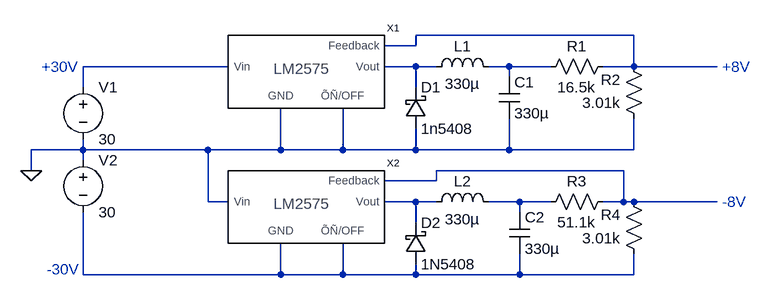
[diagram p0: schematic RapportDrawing.asc]
RapportDrawing.asc, the LTspice schematic file:
Version 4
SHEET 1 880 680
WIRE 480 -32 144 -32
WIRE 144 -16 144 -32
WIRE 144 -16 96 -16
WIRE -144 16 -368 16
WIRE 144 16 96 16
WIRE 176 16 144 16
WIRE 288 16 256 16
WIRE 352 16 288 16
WIRE 480 16 480 -32
WIRE 480 16 432 16
WIRE 608 16 480 16
WIRE 288 32 288 16
WIRE -368 48 -368 16
WIRE 144 48 144 16
WIRE -368 144 -368 128
WIRE -368 144 -448 144
WIRE -176 144 -368 144
WIRE -64 144 -64 80
WIRE -64 144 -176 144
WIRE 32 144 32 80
WIRE 32 144 -64 144
WIRE 144 144 144 112
WIRE 144 144 32 144
WIRE 288 144 288 96
WIRE 288 144 144 144
WIRE 480 144 480 96
WIRE 480 144 288 144
WIRE -368 160 -368 144
WIRE -448 176 -448 144
WIRE 464 176 176 176
WIRE 176 192 176 176
WIRE 176 192 96 192
WIRE -176 224 -176 144
WIRE -144 224 -176 224
WIRE 144 224 96 224
WIRE 176 224 144 224
WIRE 304 224 256 224
WIRE 352 224 304 224
WIRE 464 224 464 176
WIRE 464 224 432 224
WIRE 480 224 464 224
WIRE 608 224 480 224
WIRE 304 240 304 224
WIRE 144 256 144 224
WIRE -368 336 -368 240
WIRE -64 336 -64 288
WIRE -64 336 -368 336
WIRE 32 336 32 288
WIRE 32 336 -64 336
WIRE 144 336 144 320
WIRE 144 336 32 336
WIRE 304 336 304 304
WIRE 304 336 144 336
WIRE 480 336 480 304
WIRE 480 336 304 336
FLAG -448 176 0
SYMBOL LM2575 -80 64 R0
SYMATTR InstName X1
SYMBOL voltage -368 32 R0
WINDOW 123 0 0 Left 0
WINDOW 39 0 0 Left 0
SYMATTR InstName V1
SYMATTR Value 30
SYMBOL voltage -368 144 R0
WINDOW 123 0 0 Left 0
WINDOW 39 0 0 Left 0
SYMATTR InstName V2
SYMATTR Value 30
SYMBOL ind 160 32 R270
WINDOW 0 32 56 VTop 2
WINDOW 3 5 56 VBottom 2
SYMATTR InstName L1
SYMATTR Value 330µ
SYMBOL cap 272 32 R0
SYMATTR InstName C1
SYMATTR Value 330µ
SYMBOL res 448 0 R90
WINDOW 0 0 56 VBottom 2
WINDOW 3 32 56 VTop 2
SYMATTR InstName R1
SYMATTR Value 16.5k
SYMBOL res 496 112 R180
WINDOW 0 36 76 Left 2
WINDOW 3 36 40 Left 2
SYMATTR InstName R2
SYMATTR Value 3.01k
SYMBOL LM2575 -80 272 R0
SYMATTR InstName X2
SYMBOL ind 160 240 R270
WINDOW 0 32 56 VTop 2
WINDOW 3 5 56 VBottom 2
SYMATTR InstName L2
SYMATTR Value 330µ
SYMBOL cap 288 240 R0
SYMATTR InstName C2
SYMATTR Value 330µ
SYMBOL res 448 208 R90
WINDOW 0 0 56 VBottom 2
WINDOW 3 32 56 VTop 2
SYMATTR InstName R3
SYMATTR Value 51.1k
SYMBOL res 496 320 R180
WINDOW 0 36 76 Left 2
WINDOW 3 36 40 Left 2
SYMATTR InstName R4
SYMATTR Value 3.01k
SYMBOL schottky 128 112 M180
WINDOW 0 24 64 Left 2
WINDOW 3 24 0 Left 2
SYMATTR InstName D1
SYMATTR Value 1n5408
SYMATTR Description Diode
SYMATTR Type diode
SYMBOL schottky 128 320 M180
WINDOW 0 24 64 Left 2
WINDOW 3 24 0 Left 2
SYMATTR InstName D2
SYMATTR Value 1N5408
SYMATTR Description Diode
SYMATTR Type diode
TEXT 616 16 Left 2 ;+8V
TEXT 616 224 Left 2 ;-8V
TEXT -432 16 Left 2 ;+30V
TEXT -424 328 Left 2 ;-30V

The netlist it stands for:
* RapportDrawing.asc
XX1 N002 0 0 N003 N001 LM2575  ; pins Vin GND ÕÑ/OFF Vout Feedback
V1 N002 0 30
V2 0 N008 30
L1 N003 N004 330µ
C1 N004 0 330µ
R1 N001 N004 16.5k
R2 0 N001 3.01k
XX2 0 N008 N008 N006 N005 LM2575  ; pins Vin GND ÕÑ/OFF Vout Feedback
L2 N006 N007 330µ
C2 N007 N008 330µ
R3 N005 N007 51.1k
R4 N008 N005 3.01k
D1 0 N003 1n5408
D2 N008 N006 1N5408
.model D D
.lib standard.dio
* +8V
* -8V
* +30V
* -30V
.backanno
.end